# EAGLE schematic bma180-datalogger-shield (EAGLE 5.12)
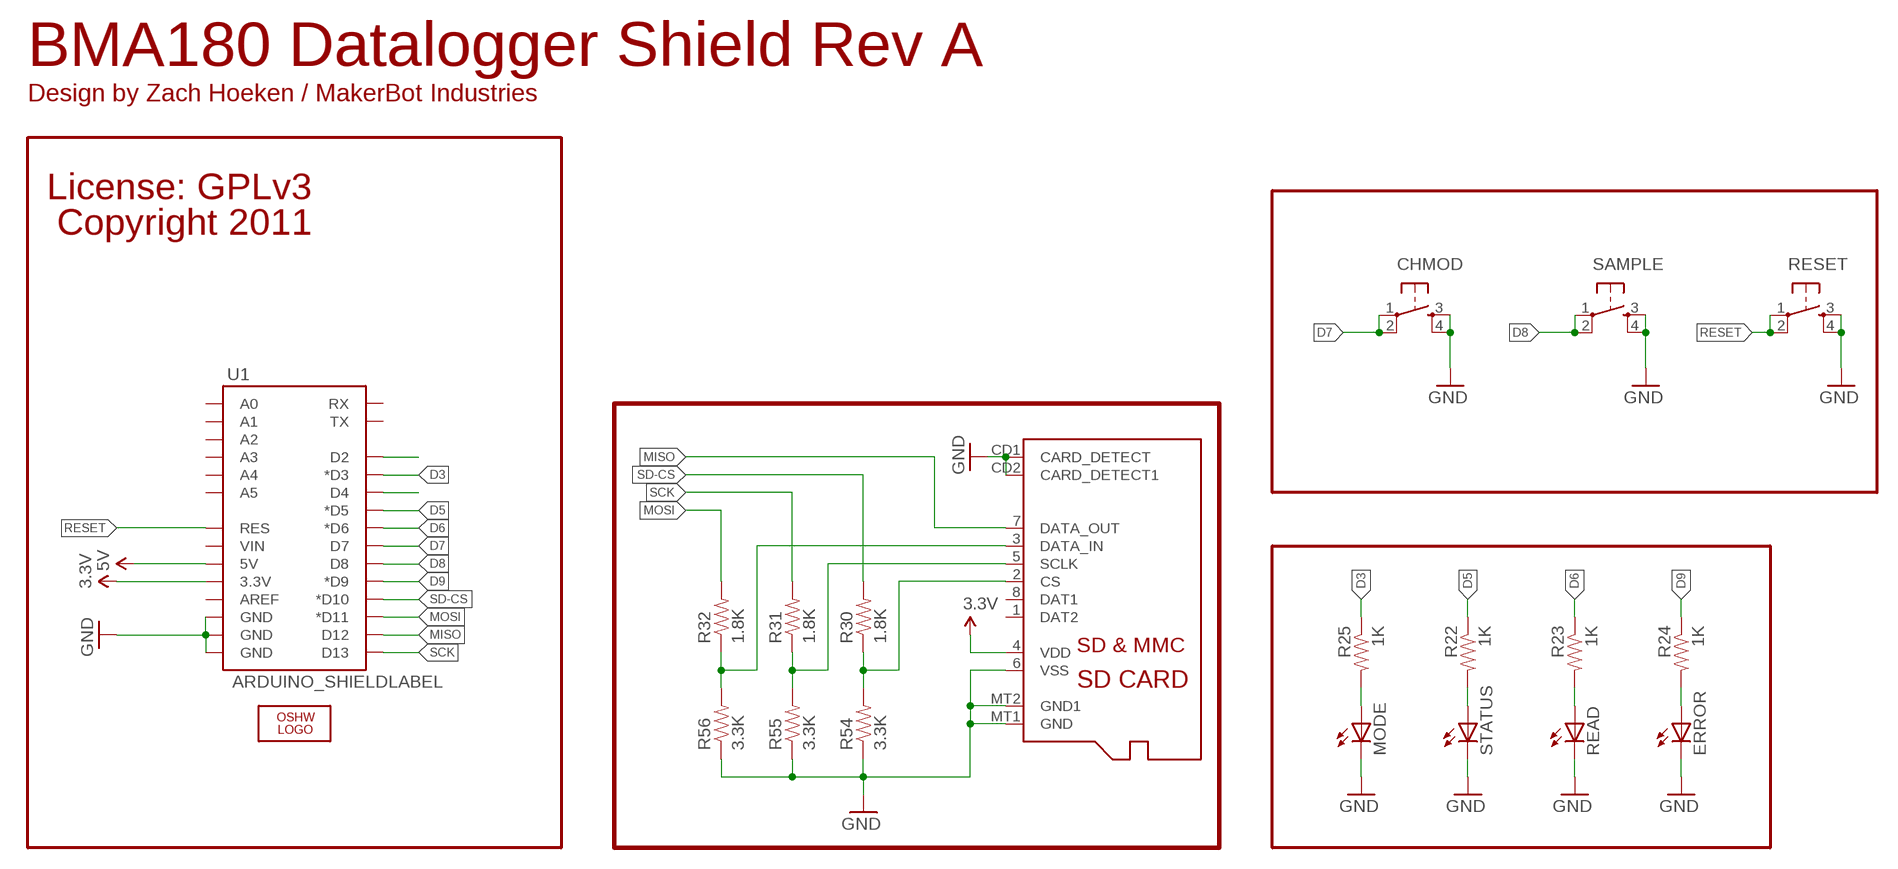
[diagram p0: schematic, sheet 1]

## Parts
CHMOD  TAC_SWITCHSMD  [TACTILE_SWITCH_SMD]
ERROR  LED1206  [LED-1206]
LOGO2  OSHW_LOGO_10MILX0200-NT  [OSHW_10X200_NOTEXT]
MODE  LED1206  [LED-1206]
MP1  DNP  MICROSD  [MICROSD]
R22  1K  RESISTOR  [0805]
R23  1K  RESISTOR  [0805]
R24  1K  RESISTOR  [0805]
R25  1K  RESISTOR  [0805]
R30  1.8K  RESISTOR  [0805]
R31  1.8K  RESISTOR  [0805]
R32  1.8K  RESISTOR  [0805]
R54  3.3K  RESISTOR  [0805]
R55  3.3K  RESISTOR  [0805]
R56  3.3K  RESISTOR  [0805]
READ  LED1206  [LED-1206]
RESET  TAC_SWITCHSMD  [TACTILE_SWITCH_SMD]
SAMPLE  TAC_SWITCHSMD  [TACTILE_SWITCH_SMD]
STATUS  LED1206  [LED-1206]
U1  ARDUINO_SHIELDLABEL  [DUEMILANOVE_SHIELD]

## Nets
3.3V [3.3V]: MP1.4(VDD) U1.3.3V
5V: U1.5V
D3: R25.1 U1.D3(*D3)
D5: R22.1 U1.D5(*D5)
D6: R23.1 U1.D6(*D6)
D7: CHMOD.1 CHMOD.2 U1.D7
D8: SAMPLE.1 SAMPLE.2 U1.D8
D9: R24.1 U1.D9(*D9)
GND [gnd]: CHMOD.3 CHMOD.4 ERROR.C MODE.C MP1.6(VSS) MP1.CD1(CARD_DETECT) MP1.CD2(CARD_DETECT1) MP1.MT1(GND) MP1.MT2(GND1) R54.1 R55.1 R56.1 READ.C RESET.3 RESET.4 SAMPLE.3 SAMPLE.4 STATUS.C U1.GND@0(GND) U1.GND@1(GND) U1.GND@2(GND)
MISO: MP1.7(DATA_OUT) U1.D12
MOSI: R32.2 U1.D11(*D11)
N$6: U1.D4
N$8: U1.D2
N$10: R22.2 STATUS.A
N$12: R23.2 READ.A
N$13: ERROR.A R24.2
N$15: MODE.A R25.2
N$219: MP1.2(CS) R30.1 R54.2
N$223: MP1.3(DATA_IN) R32.1 R56.2
N$224: MP1.5(SCLK) R31.1 R55.2
RESET: RESET.1 RESET.2 U1.RES
SCK: R31.2 U1.D13
SD-CS: R30.2 U1.D10(*D10)
Unconnected: MP1.1(DAT2) MP1.8(DAT1) U1.A0 U1.A1 U1.A2 U1.A3 U1.A4 U1.A5 U1.AREF U1.RX U1.TX U1.VIN

## Notes on the sheet
- BMA180 Datalogger Shield Rev A
- Design by Zach Hoeken / MakerBot Industries
- License: GPLv3
- Copyright 2011
- SD CARD

## Library data of the parts
CHMOD RESET SAMPLE = SparkFun:TAC_SWITCH: Momentary Switch Button commonly used for reset or general input. Spark Fun Electronics SKU : COM-00097
ERROR MODE READ STATUS = SparkFun:LED: LEDs Standard schematic elements and footprints for 5mm, 3mm, 1206, and 0603 sized LEDs. 5mm - Spark Fun Electronics SKU : COM-00529 (and others)
LOGO2 = OSHW:OSHW_LOGO_10MIL
MP1 = adafruit:MICROSD: Micro-SD / Transflash card holder with SPI pinout For the 3M # 2908-05WB-MG and/or 4UCON #19656 push-push type
R22-R25 R30-R32 R54-R56 = SparkFun:RESISTOR: Resistor Basic schematic elements and footprints for 0603, 1206, and PTH 1/10th watt (small) resistors.
U1 = SparkFun:ARDUINO_SHIELD

## Net classes
0 default: width 0.254 mm, drill 0.508 mm, clearance 0.305 mm
2 gnd: width 0.254 mm, drill 0.508 mm, clearance 0.305 mm
3 5V: width 0.254 mm, drill 0.508 mm, clearance 0.305 mm
4 3.3V: width 0.254 mm, drill 0.508 mm, clearance 0.305 mm